# Altium schematic sheet isoDebug-Isolation.SchDoc
size A4; Organization: UltraZohm
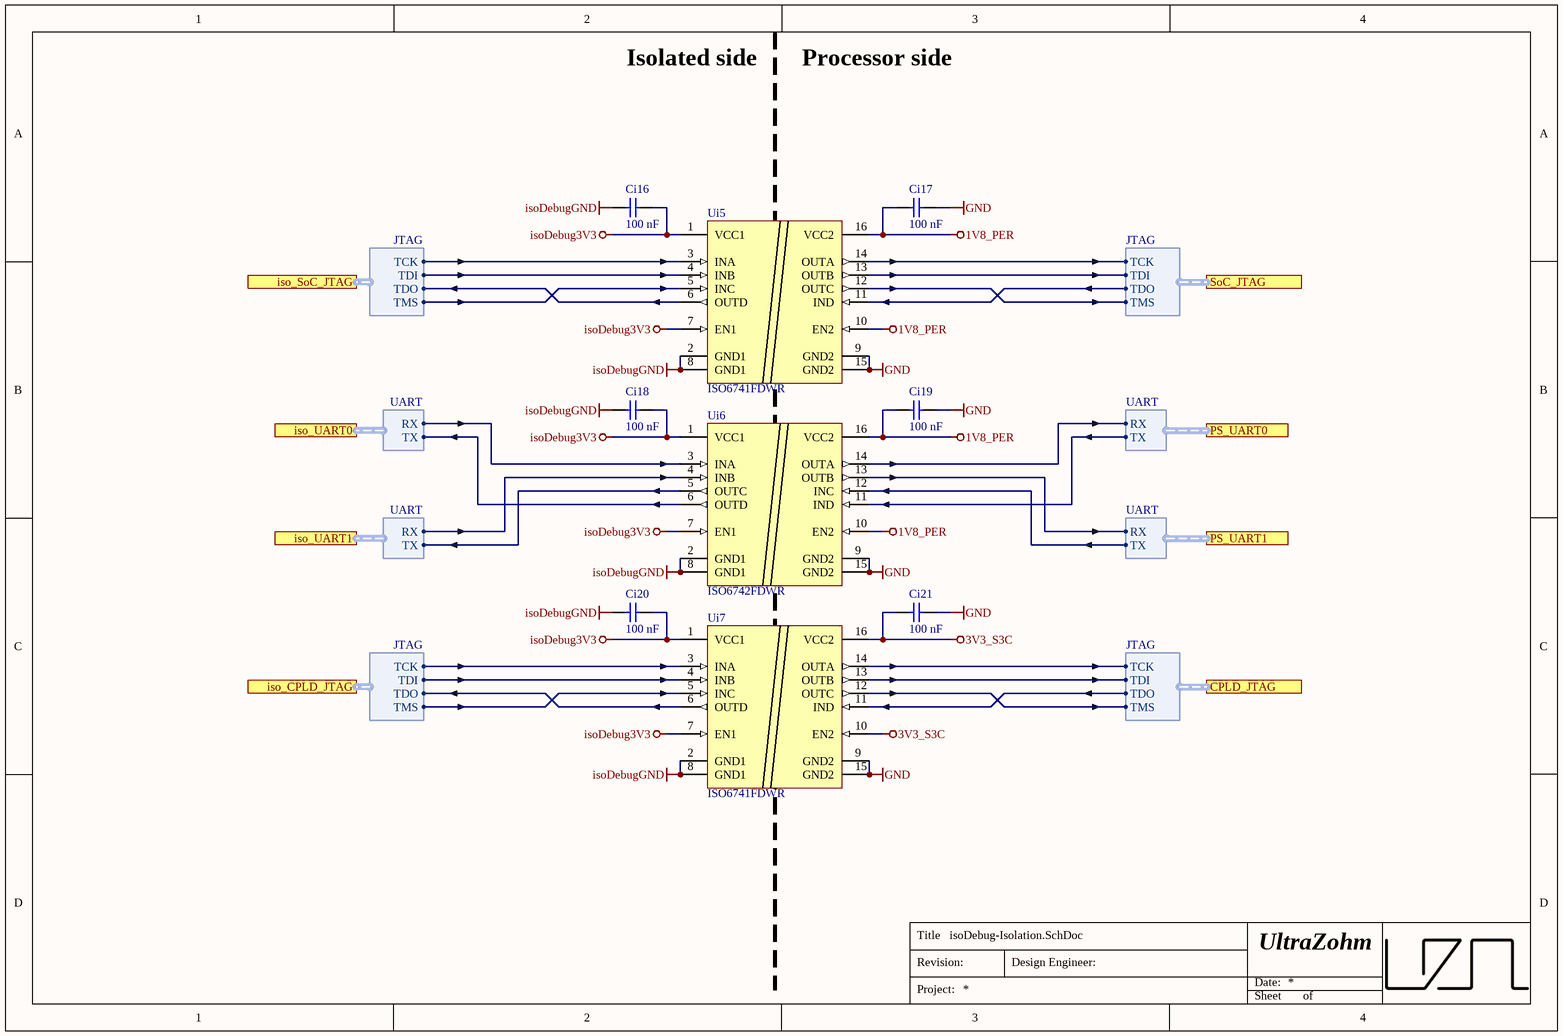
[diagram p0: isoDebug-Isolation.SchDoc]

## Parts
Ci16  100 nF  [C_0402_TE]
Ci17  100 nF  [C_0402_TE]
Ci18  100 nF  [C_0402_TE]
Ci19  100 nF  [C_0402_TE]
Ci20  100 nF  [C_0402_TE]
Ci21  100 nF  [C_0402_TE]
Ui5  ISO6741FDWR  [SOIC127P1030X265-16N]
Ui6  ISO6742FDWR  [SOIC127P1030X265-16N]
Ui7  ISO6741FDWR  [SOIC127P1030X265-16N]

## Ports
CPLD_JTAG (harness JTAG), iso_CPLD_JTAG (harness JTAG), iso_SoC_JTAG (harness JTAG), iso_UART0 (harness UART), iso_UART1 (harness UART), PS_UART0 (harness UART), PS_UART1 (harness UART), SoC_JTAG (harness JTAG)

## Harnesses
JTAG: TCK, TDI, TDO, TMS
UART: RX, TX

## Nets
1V8_PER: Ci17.2 Ci19.2 Ui5.10(EN2) Ui5.16(VCC2) Ui6.10(EN2) Ui6.16(VCC2)
3V3_S3C: Ci21.2 Ui7.10(EN2) Ui7.16(VCC2)
GND: Ci17.1 Ci19.1 Ci21.1 Ui5.9(GND2) Ui5.15(GND2) Ui6.9(GND2) Ui6.15(GND2) Ui7.9(GND2) Ui7.15(GND2)
isoDebug3V3: Ci16.1 Ci18.1 Ci20.1 Ui5.1(VCC1) Ui5.7(EN1) Ui6.1(VCC1) Ui6.7(EN1) Ui7.1(VCC1) Ui7.7(EN1)
isoDebugGND: Ci16.2 Ci18.2 Ci20.2 Ui5.2(GND1) Ui5.8(GND1) Ui6.2(GND1) Ui6.8(GND1) Ui7.2(GND1) Ui7.8(GND1)
NetUi5_3: Ui5.3(INA) ; port iso_SoC_JTAG.TCK
NetUi5_4: Ui5.4(INB) ; port iso_SoC_JTAG.TDI
NetUi5_5: Ui5.5(INC) ; port iso_SoC_JTAG.TMS
NetUi5_6: Ui5.6(OUTD) ; port iso_SoC_JTAG.TDO
NetUi5_11: Ui5.11(IND) ; port SoC_JTAG.TDO
NetUi5_12: Ui5.12(OUTC) ; port SoC_JTAG.TMS
NetUi5_13: Ui5.13(OUTB) ; port SoC_JTAG.TDI
NetUi5_14: Ui5.14(OUTA) ; port SoC_JTAG.TCK
NetUi6_3: Ui6.3(INA) ; port iso_UART0.RX
NetUi6_4: Ui6.4(INB) ; port iso_UART1.RX
NetUi6_5: Ui6.5(OUTC) ; port iso_UART1.TX
NetUi6_6: Ui6.6(OUTD) ; port iso_UART0.TX
NetUi6_11: Ui6.11(IND) ; port PS_UART0.TX
NetUi6_12: Ui6.12(INC) ; port PS_UART1.TX
NetUi6_13: Ui6.13(OUTB) ; port PS_UART1.RX
NetUi6_14: Ui6.14(OUTA) ; port PS_UART0.RX
NetUi7_3: Ui7.3(INA) ; port iso_CPLD_JTAG.TCK
NetUi7_4: Ui7.4(INB) ; port iso_CPLD_JTAG.TDI
NetUi7_5: Ui7.5(INC) ; port iso_CPLD_JTAG.TMS
NetUi7_6: Ui7.6(OUTD) ; port iso_CPLD_JTAG.TDO
NetUi7_11: Ui7.11(IND) ; port CPLD_JTAG.TDO
NetUi7_12: Ui7.12(OUTC) ; port CPLD_JTAG.TMS
NetUi7_13: Ui7.13(OUTB) ; port CPLD_JTAG.TDI
NetUi7_14: Ui7.14(OUTA) ; port CPLD_JTAG.TCK

## Notes on the sheet
- Isolated side
- Processor side
- Title
- Revision:
- Design Engineer:
- Date:
- Project:
- Sheet
- of

## Library data of the parts
Ci16-Ci21 = UZgen_C_0402_100nF_50V_X7R: Generic capacitor; Manufacturer: UZgen; Tolerance: 10 %; Created from: UZgenTool; Voltage: 50V; Manufacturer Part Number: UZgen_C_0402_100nF_50V_X7R; PartID: 3431; Created On: 02/08/2024 11:17:51; Device Package: 0402; Last Updated: 02/08/2024 11:17:51; Mounting Type: SMD; Value: 100 nF; Technology: X7R
Ui5 Ui7 = ISO6741FDWR: Digital Isolators General-purpose, quad-channel, 3/1 digital isolator 16-SOIC -40 to 125; Manufacturer: Texas Instruments; Created from: FRosner; Manufacturer Part Number: ISO6741FDWR; PartID: 6; Created On: 18/06/2024 13:06:34; ComponentLink1Description: Datasheet; ComponentLink1URL: https://www.ti.com/lit/ds/symlink/iso6741.pdf?ts=1718698076011&ref_url=https%253A%252F%252Fwww.ti.com%252Fproduct%252FISO6741; Component Type: Digital Isolator; Device Package: SOIC-16; Last Updated: 28/06/2024 13:30:42; Mounting Type: SMD; Operating Temperature: -40 to +125 °C; Series: ISO6741; Supplier 1: Mouser; Supplier Part Number 1: 595-ISO6741FDWR; Type: Digital Isolator; Value: ISO6741FDWR; LCSC Part Number: C5216433; Supplier 2: LCSC; Supplier Part Number 2: C5216433
Ui6 = ISO6742FDWR: Digital Isolators General-purpose, quad-channel, 2/2 digital isolator; Manufacturer: Texas Instruments; Created from: FRosner; Manufacturer Part Number: ISO6742FDWR; PartID: 5; Created On: 18/06/2024 12:17:11; ComponentLink1Description: Datasheet; ComponentLink1URL: https://www.ti.com/lit/ds/symlink/iso6742.pdf?ts=1718696457648&ref_url=https%253A%252F%252Fwww.mouser.de%252F; Component Type: Digital Isolator; Device Package: SOIC-16; Last Updated: 18/06/2024 14:14:19; Mounting Type: SMD; Operating Temperature: -40 to +125 °C; Series: ISO6742; Supplier 1: Mouser; Supplier Part Number 1: 595-ISO6742FDWR; Type: Digital Isolator; Value: ISO6742FDWR; LCSC Part Number: C5216408; Supplier 2: LCSC; Supplier Part Number 2: C5216408